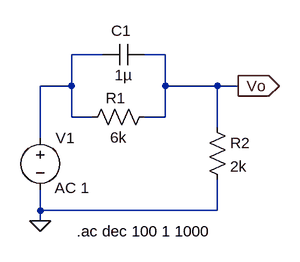
[diagram p0: schematic passive_filter_high_pass.asc]
passive_filter_high_pass.asc, the LTspice schematic file:
Version 4
SHEET 1 880 680
WIRE 112 32 64 32
WIRE 208 32 176 32
WIRE 64 80 64 32
WIRE 64 80 16 80
WIRE 208 80 208 32
WIRE 288 80 208 80
WIRE 320 80 288 80
WIRE 64 128 64 80
WIRE 96 128 64 128
WIRE 208 128 208 80
WIRE 208 128 176 128
WIRE 288 144 288 80
WIRE 16 160 16 80
WIRE 16 272 16 240
WIRE 288 272 288 224
WIRE 288 272 16 272
WIRE 16 288 16 272
FLAG 16 288 0
FLAG 320 80 Vo
IOPIN 320 80 Out
SYMBOL res 272 128 R0
SYMATTR InstName R2
SYMATTR Value 2k
SYMBOL res 80 144 R270
WINDOW 0 30 52 VTop 2
WINDOW 3 0 56 VBottom 2
SYMATTR InstName R1
SYMATTR Value 6k
SYMBOL cap 112 48 R270
WINDOW 0 37 28 VTop 2
WINDOW 3 0 32 VBottom 2
SYMATTR InstName C1
SYMATTR Value 1µ
SYMBOL voltage 16 144 R0
WINDOW 123 22 93 Left 2
WINDOW 39 0 0 Left 2
SYMATTR Value2 AC 1
SYMATTR InstName V1
SYMATTR Value ""
TEXT 72 304 Left 2 !.ac dec 100 1 1000

The netlist it stands for:
* passive_filter_high_pass.asc
R2 Vo 0 2k
R1 N001 Vo 6k
C1 N001 Vo 1µ
V1 N001 0 AC 1
.ac dec 100 1 1000
.backanno
.end